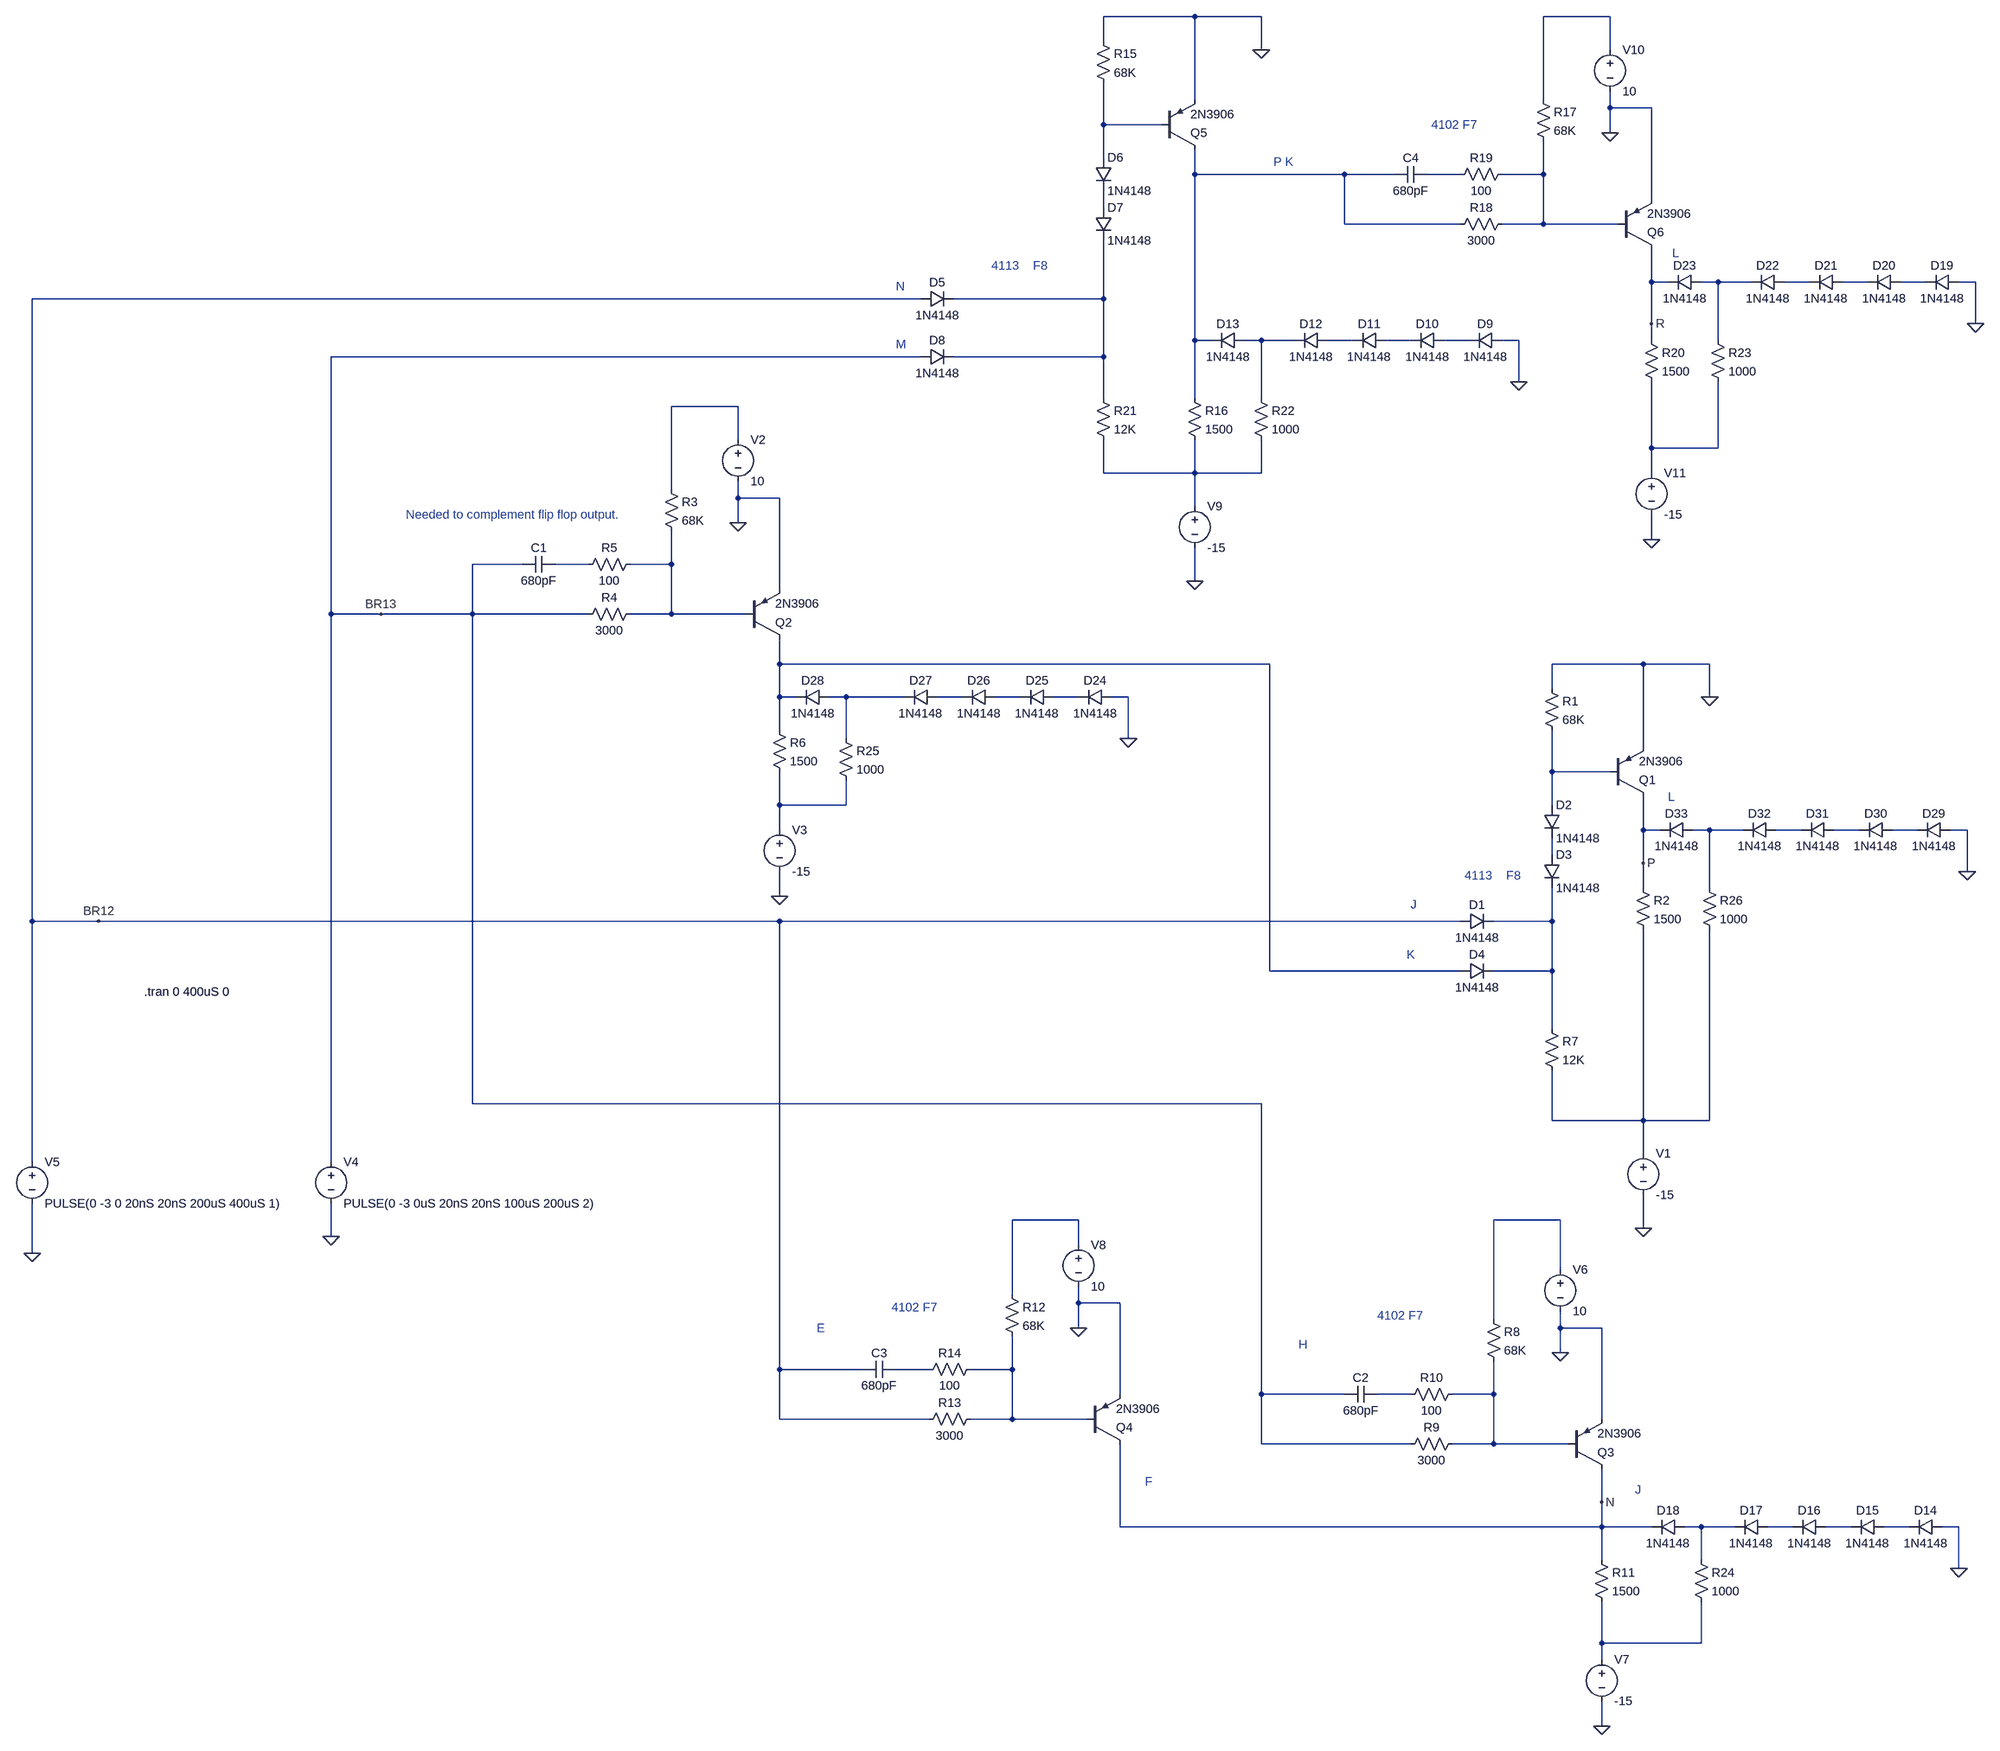
[diagram p0: schematic speed_up_logic.asc]
speed_up_logic.asc, the LTspice schematic file:
Version 4
SHEET 1 1652 1924
WIRE 128 -1392 -48 -1392
WIRE 256 -1392 128 -1392
WIRE 928 -1392 800 -1392
WIRE -48 -1344 -48 -1392
WIRE 256 -1328 256 -1392
WIRE 928 -1328 928 -1392
WIRE 128 -1232 128 -1392
WIRE 800 -1232 800 -1392
WIRE 928 -1216 928 -1248
WIRE 1008 -1216 928 -1216
WIRE -48 -1184 -48 -1264
WIRE 64 -1184 -48 -1184
WIRE 928 -1168 928 -1216
WIRE -48 -1120 -48 -1184
WIRE 128 -1088 128 -1136
WIRE 416 -1088 128 -1088
WIRE 512 -1088 416 -1088
WIRE 640 -1088 576 -1088
WIRE 800 -1088 800 -1152
WIRE 800 -1088 720 -1088
WIRE 1008 -1040 1008 -1216
WIRE -48 -1024 -48 -1056
WIRE 416 -992 416 -1088
WIRE 640 -992 416 -992
WIRE 800 -992 800 -1088
WIRE 800 -992 720 -992
WIRE 944 -992 800 -992
WIRE 1008 -880 1008 -944
WIRE 1040 -880 1008 -880
WIRE 1136 -880 1104 -880
WIRE 1200 -880 1136 -880
WIRE 1312 -880 1264 -880
WIRE 1424 -880 1376 -880
WIRE 1536 -880 1488 -880
WIRE 1632 -880 1600 -880
WIRE -400 -848 -2112 -848
WIRE -48 -848 -48 -960
WIRE -48 -848 -336 -848
WIRE 1008 -800 1008 -880
WIRE 1632 -800 1632 -880
WIRE 128 -768 128 -1088
WIRE 160 -768 128 -768
WIRE 256 -768 224 -768
WIRE 320 -768 256 -768
WIRE 432 -768 384 -768
WIRE 544 -768 496 -768
WIRE 656 -768 608 -768
WIRE 752 -768 720 -768
WIRE 1008 -768 1008 -800
WIRE 1136 -768 1136 -880
WIRE -400 -736 -1536 -736
WIRE -48 -736 -48 -848
WIRE -48 -736 -336 -736
WIRE 752 -688 752 -768
WIRE -48 -656 -48 -736
WIRE 128 -656 128 -768
WIRE 256 -656 256 -768
WIRE -752 -640 -880 -640
WIRE -752 -576 -752 -640
WIRE 1008 -560 1008 -688
WIRE 1136 -560 1136 -688
WIRE 1136 -560 1008 -560
WIRE -48 -512 -48 -576
WIRE 128 -512 128 -576
WIRE 128 -512 -48 -512
WIRE 256 -512 256 -576
WIRE 256 -512 128 -512
WIRE 1008 -512 1008 -560
WIRE -880 -480 -880 -640
WIRE -752 -464 -752 -496
WIRE -672 -464 -752 -464
WIRE 128 -448 128 -512
WIRE -752 -416 -752 -464
WIRE 1008 -384 1008 -432
WIRE -1168 -336 -1264 -336
WIRE -1040 -336 -1104 -336
WIRE -880 -336 -880 -400
WIRE -880 -336 -960 -336
WIRE 128 -304 128 -368
WIRE -672 -288 -672 -464
WIRE -1536 -240 -1536 -736
WIRE -1440 -240 -1536 -240
WIRE -1264 -240 -1264 -336
WIRE -1264 -240 -1440 -240
WIRE -1040 -240 -1264 -240
WIRE -880 -240 -880 -336
WIRE -880 -240 -960 -240
WIRE -736 -240 -880 -240
WIRE -672 -144 -672 -192
WIRE 272 -144 -672 -144
WIRE 992 -144 816 -144
WIRE 1120 -144 992 -144
WIRE 816 -96 816 -144
WIRE -672 -80 -672 -144
WIRE -640 -80 -672 -80
WIRE -544 -80 -576 -80
WIRE -432 -80 -544 -80
WIRE -320 -80 -368 -80
WIRE -208 -80 -256 -80
WIRE -96 -80 -144 -80
WIRE 0 -80 -32 -80
WIRE 1120 -80 1120 -144
WIRE -672 -16 -672 -80
WIRE -544 0 -544 -80
WIRE 0 0 0 -80
WIRE 992 16 992 -144
WIRE 816 64 816 -16
WIRE 928 64 816 64
WIRE -672 128 -672 64
WIRE -544 128 -544 80
WIRE -544 128 -672 128
WIRE 816 128 816 64
WIRE -672 176 -672 128
WIRE 992 176 992 112
WIRE 1024 176 992 176
WIRE 1120 176 1088 176
WIRE 1184 176 1120 176
WIRE 1296 176 1248 176
WIRE 1408 176 1360 176
WIRE 1520 176 1472 176
WIRE 1616 176 1584 176
WIRE 816 224 816 192
WIRE 992 240 992 176
WIRE 1616 256 1616 176
WIRE 992 288 992 240
WIRE 1120 288 1120 176
WIRE -672 304 -672 256
WIRE -2112 352 -2112 -848
WIRE -1984 352 -2112 352
WIRE -672 352 -1984 352
WIRE 640 352 -672 352
WIRE 816 352 816 288
WIRE 816 352 704 352
WIRE 272 448 272 -144
WIRE 640 448 272 448
WIRE 816 448 816 352
WIRE 816 448 704 448
WIRE 816 560 816 448
WIRE -1264 704 -1264 -240
WIRE 256 704 -1264 704
WIRE 816 736 816 640
WIRE 992 736 992 368
WIRE 992 736 816 736
WIRE 1120 736 1120 368
WIRE 1120 736 992 736
WIRE 992 800 992 736
WIRE -2112 816 -2112 352
WIRE -1536 816 -1536 -240
WIRE -96 928 -224 928
WIRE 832 928 704 928
WIRE 992 944 992 880
WIRE -1536 960 -1536 896
WIRE -96 976 -96 928
WIRE -2112 992 -2112 896
WIRE 832 1024 832 928
WIRE -224 1072 -224 928
WIRE -96 1088 -96 1056
WIRE -16 1088 -96 1088
WIRE 704 1120 704 928
WIRE -96 1136 -96 1088
WIRE 832 1136 832 1104
WIRE 912 1136 832 1136
WIRE 832 1184 832 1136
WIRE -672 1216 -672 352
WIRE -512 1216 -672 1216
WIRE -384 1216 -448 1216
WIRE -224 1216 -224 1152
WIRE -224 1216 -304 1216
WIRE -16 1264 -16 1088
WIRE 256 1264 256 704
WIRE 416 1264 256 1264
WIRE 544 1264 480 1264
WIRE 704 1264 704 1200
WIRE 704 1264 624 1264
WIRE -672 1312 -672 1216
WIRE -384 1312 -672 1312
WIRE -224 1312 -224 1216
WIRE -224 1312 -304 1312
WIRE -80 1312 -224 1312
WIRE 912 1312 912 1136
WIRE 256 1360 256 1264
WIRE 544 1360 256 1360
WIRE 704 1360 704 1264
WIRE 704 1360 624 1360
WIRE 848 1360 704 1360
WIRE 912 1472 912 1408
WIRE -16 1520 -16 1360
WIRE 912 1520 912 1472
WIRE 912 1520 -16 1520
WIRE 1008 1520 912 1520
WIRE 1104 1520 1072 1520
WIRE 1168 1520 1104 1520
WIRE 1280 1520 1232 1520
WIRE 1392 1520 1344 1520
WIRE 1504 1520 1456 1520
WIRE 1600 1520 1568 1520
WIRE 912 1584 912 1520
WIRE 1104 1584 1104 1520
WIRE 1600 1600 1600 1520
WIRE 912 1744 912 1664
WIRE 1104 1744 1104 1664
WIRE 1104 1744 912 1744
WIRE 912 1776 912 1744
WIRE 912 1904 912 1856
FLAG 992 944 0
FLAG -1536 960 0
FLAG -2112 992 0
FLAG 1120 -80 0
FLAG 832 1184 0
FLAG 912 1904 0
FLAG -96 1136 0
FLAG 128 -304 0
FLAG 928 -1168 0
FLAG 1008 -384 0
FLAG 256 -1328 0
FLAG -752 -416 0
FLAG -672 304 0
FLAG -1984 352 BR12
FLAG -1440 -240 BR13
FLAG 992 240 P
FLAG 912 1472 N
FLAG 1008 -800 R
FLAG 752 -688 0
FLAG 1600 1600 0
FLAG 1632 -800 0
FLAG 0 0 0
FLAG 1616 256 0
SYMBOL pnp 928 112 M180
SYMATTR InstName Q1
SYMATTR Value 2N3906
SYMBOL diode 640 336 M90
WINDOW 0 0 32 VBottom 2
WINDOW 3 32 32 VTop 2
SYMATTR InstName D1
SYMATTR Value 1N4148
SYMBOL res 800 -112 R0
SYMATTR InstName R1
SYMATTR Value 68K
SYMBOL diode 800 128 R0
SYMATTR InstName D2
SYMATTR Value 1N4148
SYMBOL diode 800 224 R0
SYMATTR InstName D3
SYMATTR Value 1N4148
SYMBOL diode 640 432 M90
WINDOW 0 0 32 VBottom 2
WINDOW 3 32 32 VTop 2
SYMATTR InstName D4
SYMATTR Value 1N4148
SYMBOL res 976 272 R0
SYMATTR InstName R2
SYMATTR Value 1500
SYMBOL voltage 992 784 R0
WINDOW 123 0 0 Left 0
WINDOW 39 0 0 Left 0
SYMATTR InstName V1
SYMATTR Value -15
SYMBOL voltage -2112 800 R0
WINDOW 123 0 0 Left 0
WINDOW 39 0 0 Left 0
SYMATTR InstName V5
SYMATTR Value PULSE(0 -3 0 20nS 20nS 200uS 400uS 1)
SYMBOL res 800 544 R0
SYMATTR InstName R7
SYMATTR Value 12K
SYMBOL voltage -1536 800 R0
WINDOW 123 0 0 Left 0
WINDOW 39 0 0 Left 0
SYMATTR InstName V4
SYMATTR Value PULSE(0 -3 0uS 20nS 20nS 100uS 200uS 2)
SYMBOL pnp 848 1408 M180
SYMATTR InstName Q3
SYMATTR Value 2N3906
SYMBOL res 688 1104 R0
SYMATTR InstName R8
SYMATTR Value 68K
SYMBOL voltage 832 1008 R0
WINDOW 123 0 0 Left 0
WINDOW 39 0 0 Left 0
SYMATTR InstName V6
SYMATTR Value 10
SYMBOL res 640 1344 R90
WINDOW 0 0 56 VBottom 2
WINDOW 3 32 56 VTop 2
SYMATTR InstName R9
SYMATTR Value 3000
SYMBOL cap 480 1248 R90
WINDOW 0 0 32 VBottom 2
WINDOW 3 32 32 VTop 2
SYMATTR InstName C2
SYMATTR Value 680pF
SYMBOL res 640 1248 R90
WINDOW 0 0 56 VBottom 2
WINDOW 3 32 56 VTop 2
SYMATTR InstName R10
SYMATTR Value 100
SYMBOL res 896 1568 R0
SYMATTR InstName R11
SYMATTR Value 1500
SYMBOL voltage 912 1760 R0
WINDOW 123 0 0 Left 0
WINDOW 39 0 0 Left 0
SYMATTR InstName V7
SYMATTR Value -15
SYMBOL pnp -80 1360 M180
SYMATTR InstName Q4
SYMATTR Value 2N3906
SYMBOL res -240 1056 R0
SYMATTR InstName R12
SYMATTR Value 68K
SYMBOL voltage -96 960 R0
WINDOW 123 0 0 Left 0
WINDOW 39 0 0 Left 0
SYMATTR InstName V8
SYMATTR Value 10
SYMBOL res -288 1296 R90
WINDOW 0 0 56 VBottom 2
WINDOW 3 32 56 VTop 2
SYMATTR InstName R13
SYMATTR Value 3000
SYMBOL cap -448 1200 R90
WINDOW 0 0 32 VBottom 2
WINDOW 3 32 32 VTop 2
SYMATTR InstName C3
SYMATTR Value 680pF
SYMBOL res -288 1200 R90
WINDOW 0 0 56 VBottom 2
WINDOW 3 32 56 VTop 2
SYMATTR InstName R14
SYMATTR Value 100
SYMBOL pnp 64 -1136 M180
SYMATTR InstName Q5
SYMATTR Value 2N3906
SYMBOL diode -400 -864 M90
WINDOW 0 0 32 VBottom 2
WINDOW 3 32 32 VTop 2
SYMATTR InstName D5
SYMATTR Value 1N4148
SYMBOL res -64 -1360 R0
SYMATTR InstName R15
SYMATTR Value 68K
SYMBOL diode -64 -1120 R0
SYMATTR InstName D6
SYMATTR Value 1N4148
SYMBOL diode -64 -1024 R0
SYMATTR InstName D7
SYMATTR Value 1N4148
SYMBOL diode -400 -752 M90
WINDOW 0 0 32 VBottom 2
WINDOW 3 32 32 VTop 2
SYMATTR InstName D8
SYMATTR Value 1N4148
SYMBOL res 112 -672 R0
SYMATTR InstName R16
SYMATTR Value 1500
SYMBOL voltage 128 -464 R0
WINDOW 123 0 0 Left 0
WINDOW 39 0 0 Left 0
SYMATTR InstName V9
SYMATTR Value -15
SYMBOL pnp 944 -944 M180
SYMATTR InstName Q6
SYMATTR Value 2N3906
SYMBOL res 784 -1248 R0
SYMATTR InstName R17
SYMATTR Value 68K
SYMBOL voltage 928 -1344 R0
WINDOW 123 0 0 Left 0
WINDOW 39 0 0 Left 0
SYMATTR InstName V10
SYMATTR Value 10
SYMBOL res 736 -1008 R90
WINDOW 0 0 56 VBottom 2
WINDOW 3 32 56 VTop 2
SYMATTR InstName R18
SYMATTR Value 3000
SYMBOL cap 576 -1104 R90
WINDOW 0 0 32 VBottom 2
WINDOW 3 32 32 VTop 2
SYMATTR InstName C4
SYMATTR Value 680pF
SYMBOL res 736 -1104 R90
WINDOW 0 0 56 VBottom 2
WINDOW 3 32 56 VTop 2
SYMATTR InstName R19
SYMATTR Value 100
SYMBOL res 992 -784 R0
SYMATTR InstName R20
SYMATTR Value 1500
SYMBOL voltage 1008 -528 R0
WINDOW 123 0 0 Left 0
WINDOW 39 0 0 Left 0
SYMATTR InstName V11
SYMATTR Value -15
SYMBOL res -64 -672 R0
SYMATTR InstName R21
SYMATTR Value 12K
SYMBOL pnp -736 -192 M180
SYMATTR InstName Q2
SYMATTR Value 2N3906
SYMBOL res -896 -496 R0
SYMATTR InstName R3
SYMATTR Value 68K
SYMBOL voltage -752 -592 R0
WINDOW 123 0 0 Left 0
WINDOW 39 0 0 Left 0
SYMATTR InstName V2
SYMATTR Value 10
SYMBOL res -944 -256 R90
WINDOW 0 0 56 VBottom 2
WINDOW 3 32 56 VTop 2
SYMATTR InstName R4
SYMATTR Value 3000
SYMBOL cap -1104 -352 R90
WINDOW 0 0 32 VBottom 2
WINDOW 3 32 32 VTop 2
SYMATTR InstName C1
SYMATTR Value 680pF
SYMBOL res -944 -352 R90
WINDOW 0 0 56 VBottom 2
WINDOW 3 32 56 VTop 2
SYMATTR InstName R5
SYMATTR Value 100
SYMBOL res -688 -32 R0
SYMATTR InstName R6
SYMATTR Value 1500
SYMBOL voltage -672 160 R0
WINDOW 123 0 0 Left 0
WINDOW 39 0 0 Left 0
SYMATTR InstName V3
SYMATTR Value -15
SYMBOL diode 720 -784 R90
WINDOW 0 0 32 VBottom 2
WINDOW 3 32 32 VTop 2
SYMATTR InstName D9
SYMATTR Value 1N4148
SYMBOL diode 608 -784 R90
WINDOW 0 0 32 VBottom 2
WINDOW 3 32 32 VTop 2
SYMATTR InstName D10
SYMATTR Value 1N4148
SYMBOL diode 496 -784 R90
WINDOW 0 0 32 VBottom 2
WINDOW 3 32 32 VTop 2
SYMATTR InstName D11
SYMATTR Value 1N4148
SYMBOL diode 384 -784 R90
WINDOW 0 0 32 VBottom 2
WINDOW 3 32 32 VTop 2
SYMATTR InstName D12
SYMATTR Value 1N4148
SYMBOL res 240 -672 R0
SYMATTR InstName R22
SYMATTR Value 1000
SYMBOL diode 224 -784 R90
WINDOW 0 0 32 VBottom 2
WINDOW 3 32 32 VTop 2
SYMATTR InstName D13
SYMATTR Value 1N4148
SYMBOL diode 1568 1504 R90
WINDOW 0 0 32 VBottom 2
WINDOW 3 32 32 VTop 2
SYMATTR InstName D14
SYMATTR Value 1N4148
SYMBOL diode 1456 1504 R90
WINDOW 0 0 32 VBottom 2
WINDOW 3 32 32 VTop 2
SYMATTR InstName D15
SYMATTR Value 1N4148
SYMBOL diode 1344 1504 R90
WINDOW 0 0 32 VBottom 2
WINDOW 3 32 32 VTop 2
SYMATTR InstName D16
SYMATTR Value 1N4148
SYMBOL diode 1232 1504 R90
WINDOW 0 0 32 VBottom 2
WINDOW 3 32 32 VTop 2
SYMATTR InstName D17
SYMATTR Value 1N4148
SYMBOL res 1088 1568 R0
SYMATTR InstName R24
SYMATTR Value 1000
SYMBOL diode 1072 1504 R90
WINDOW 0 0 32 VBottom 2
WINDOW 3 32 32 VTop 2
SYMATTR InstName D18
SYMATTR Value 1N4148
SYMBOL diode 1600 -896 R90
WINDOW 0 0 32 VBottom 2
WINDOW 3 32 32 VTop 2
SYMATTR InstName D19
SYMATTR Value 1N4148
SYMBOL diode 1488 -896 R90
WINDOW 0 0 32 VBottom 2
WINDOW 3 32 32 VTop 2
SYMATTR InstName D20
SYMATTR Value 1N4148
SYMBOL diode 1376 -896 R90
WINDOW 0 0 32 VBottom 2
WINDOW 3 32 32 VTop 2
SYMATTR InstName D21
SYMATTR Value 1N4148
SYMBOL diode 1264 -896 R90
WINDOW 0 0 32 VBottom 2
WINDOW 3 32 32 VTop 2
SYMATTR InstName D22
SYMATTR Value 1N4148
SYMBOL res 1120 -784 R0
SYMATTR InstName R23
SYMATTR Value 1000
SYMBOL diode 1104 -896 R90
WINDOW 0 0 32 VBottom 2
WINDOW 3 32 32 VTop 2
SYMATTR InstName D23
SYMATTR Value 1N4148
SYMBOL diode -32 -96 R90
WINDOW 0 0 32 VBottom 2
WINDOW 3 32 32 VTop 2
SYMATTR InstName D24
SYMATTR Value 1N4148
SYMBOL diode -144 -96 R90
WINDOW 0 0 32 VBottom 2
WINDOW 3 32 32 VTop 2
SYMATTR InstName D25
SYMATTR Value 1N4148
SYMBOL diode -256 -96 R90
WINDOW 0 0 32 VBottom 2
WINDOW 3 32 32 VTop 2
SYMATTR InstName D26
SYMATTR Value 1N4148
SYMBOL diode -368 -96 R90
WINDOW 0 0 32 VBottom 2
WINDOW 3 32 32 VTop 2
SYMATTR InstName D27
SYMATTR Value 1N4148
SYMBOL res -560 -16 R0
SYMATTR InstName R25
SYMATTR Value 1000
SYMBOL diode -576 -96 R90
WINDOW 0 0 32 VBottom 2
WINDOW 3 32 32 VTop 2
SYMATTR InstName D28
SYMATTR Value 1N4148
SYMBOL diode 1584 160 R90
WINDOW 0 0 32 VBottom 2
WINDOW 3 32 32 VTop 2
SYMATTR InstName D29
SYMATTR Value 1N4148
SYMBOL diode 1472 160 R90
WINDOW 0 0 32 VBottom 2
WINDOW 3 32 32 VTop 2
SYMATTR InstName D30
SYMATTR Value 1N4148
SYMBOL diode 1360 160 R90
WINDOW 0 0 32 VBottom 2
WINDOW 3 32 32 VTop 2
SYMATTR InstName D31
SYMATTR Value 1N4148
SYMBOL diode 1248 160 R90
WINDOW 0 0 32 VBottom 2
WINDOW 3 32 32 VTop 2
SYMATTR InstName D32
SYMATTR Value 1N4148
SYMBOL res 1104 272 R0
SYMATTR InstName R26
SYMATTR Value 1000
SYMBOL diode 1088 160 R90
WINDOW 0 0 32 VBottom 2
WINDOW 3 32 32 VTop 2
SYMATTR InstName D33
SYMATTR Value 1N4148
TEXT -1896 488 Left 2 !.tran 0 400uS 0
TEXT -448 -872 Left 2 ;N
TEXT -448 -760 Left 2 ;M
TEXT 280 -1112 Left 2 ;P K
TEXT -264 -912 Left 2 ;4113    F8
TEXT 648 264 Left 2 ;4113    F8
TEXT 1048 -936 Left 2 ;L
TEXT 584 -1184 Left 2 ;4102 F7
TEXT -1392 -432 Left 2 ;Needed to complement flip flop output.
TEXT 536 416 Left 2 ;K
TEXT 544 320 Left 2 ;J
TEXT 1040 112 Left 2 ;L
TEXT -600 1136 Left 2 ;E
TEXT 328 1168 Left 2 ;H
TEXT 976 1448 Left 2 ;J
TEXT 32 1432 Left 2 ;F
TEXT -456 1096 Left 2 ;4102 F7
TEXT 480 1112 Left 2 ;4102 F7

The netlist it stands for:
* speed_up_logic.asc
Q1 P N026 0 0 2N3906
D1 BR12 N033 1N4148
R1 0 N026 68K
D2 N026 N032 1N4148
D3 N032 N033 1N4148
D4 N021 N033 1N4148
R2 P N034 1500
V1 N034 0 -15
V5 BR12 0 PULSE(0 -3 0 20nS 20nS 200uS 400uS 1)
R7 N033 N034 12K
V4 BR13 0 PULSE(0 -3 0uS 20nS 20nS 100uS 200uS 2)
Q3 N N040 0 0 2N3906
R8 N036 N040 68K
V6 N036 0 10
R9 N040 BR13 3000
C2 N039 BR13 680pF
R10 N040 N039 100
R11 N N045 1500
V7 N045 0 -15
Q4 N N038 0 0 2N3906
R12 N035 N038 68K
V8 N035 0 10
R13 N038 BR12 3000
C3 N037 BR12 680pF
R14 N038 N037 100
Q5 N003 N002 0 0 2N3906
D5 BR12 N011 1N4148
R15 0 N002 68K
D6 N002 N006 1N4148
D7 N006 N011 1N4148
D8 BR13 N011 1N4148
R16 N003 N018 1500
V9 N018 0 -15
Q6 R N005 0 0 2N3906
R17 N001 N005 68K
V10 N001 0 10
R18 N005 N003 3000
C4 N004 N003 680pF
R19 N005 N004 100
R20 R N017 1500
V11 N017 0 -15
R21 N011 N018 12K
Q2 N021 N020 0 0 2N3906
R3 N016 N020 68K
V2 N016 0 10
R4 N020 BR13 3000
C1 N019 BR13 680pF
R5 N020 N019 100
R6 N021 N027 1500
V3 N027 0 -15
D9 0 N015 1N4148
D10 N015 N014 1N4148
D11 N014 N013 1N4148
D12 N013 N012 1N4148
R22 N012 N018 1000
D13 N012 N003 1N4148
D14 0 N044 1N4148
D15 N044 N043 1N4148
D16 N043 N042 1N4148
D17 N042 N041 1N4148
R24 N041 N045 1000
D18 N041 N 1N4148
D19 0 N010 1N4148
D20 N010 N009 1N4148
D21 N009 N008 1N4148
D22 N008 N007 1N4148
R23 N007 N017 1000
D23 N007 R 1N4148
D24 0 N025 1N4148
D25 N025 N024 1N4148
D26 N024 N023 1N4148
D27 N023 N022 1N4148
R25 N022 N027 1000
D28 N022 N021 1N4148
D29 0 N031 1N4148
D30 N031 N030 1N4148
D31 N030 N029 1N4148
D32 N029 N028 1N4148
R26 N028 N034 1000
D33 N028 P 1N4148
.model D D
.lib standard.dio
.model NPN NPN
.model PNP PNP
.lib standard.bjt
.tran 0 400uS 0
* N
* M
* P K
* 4113    F8
* 4113    F8
* L
* 4102 F7
* Needed to complement flip flop output.
* K
* J
* L
* E
* H
* J
* F
* 4102 F7
* 4102 F7
.backanno
.end